# EAGLE schematic source_eagle (EAGLE 9.6.2)
COMPANY: ADAFRUIT INDUSTRIES; DRAWN: KTOWN; REV: A; YEAR: 2017
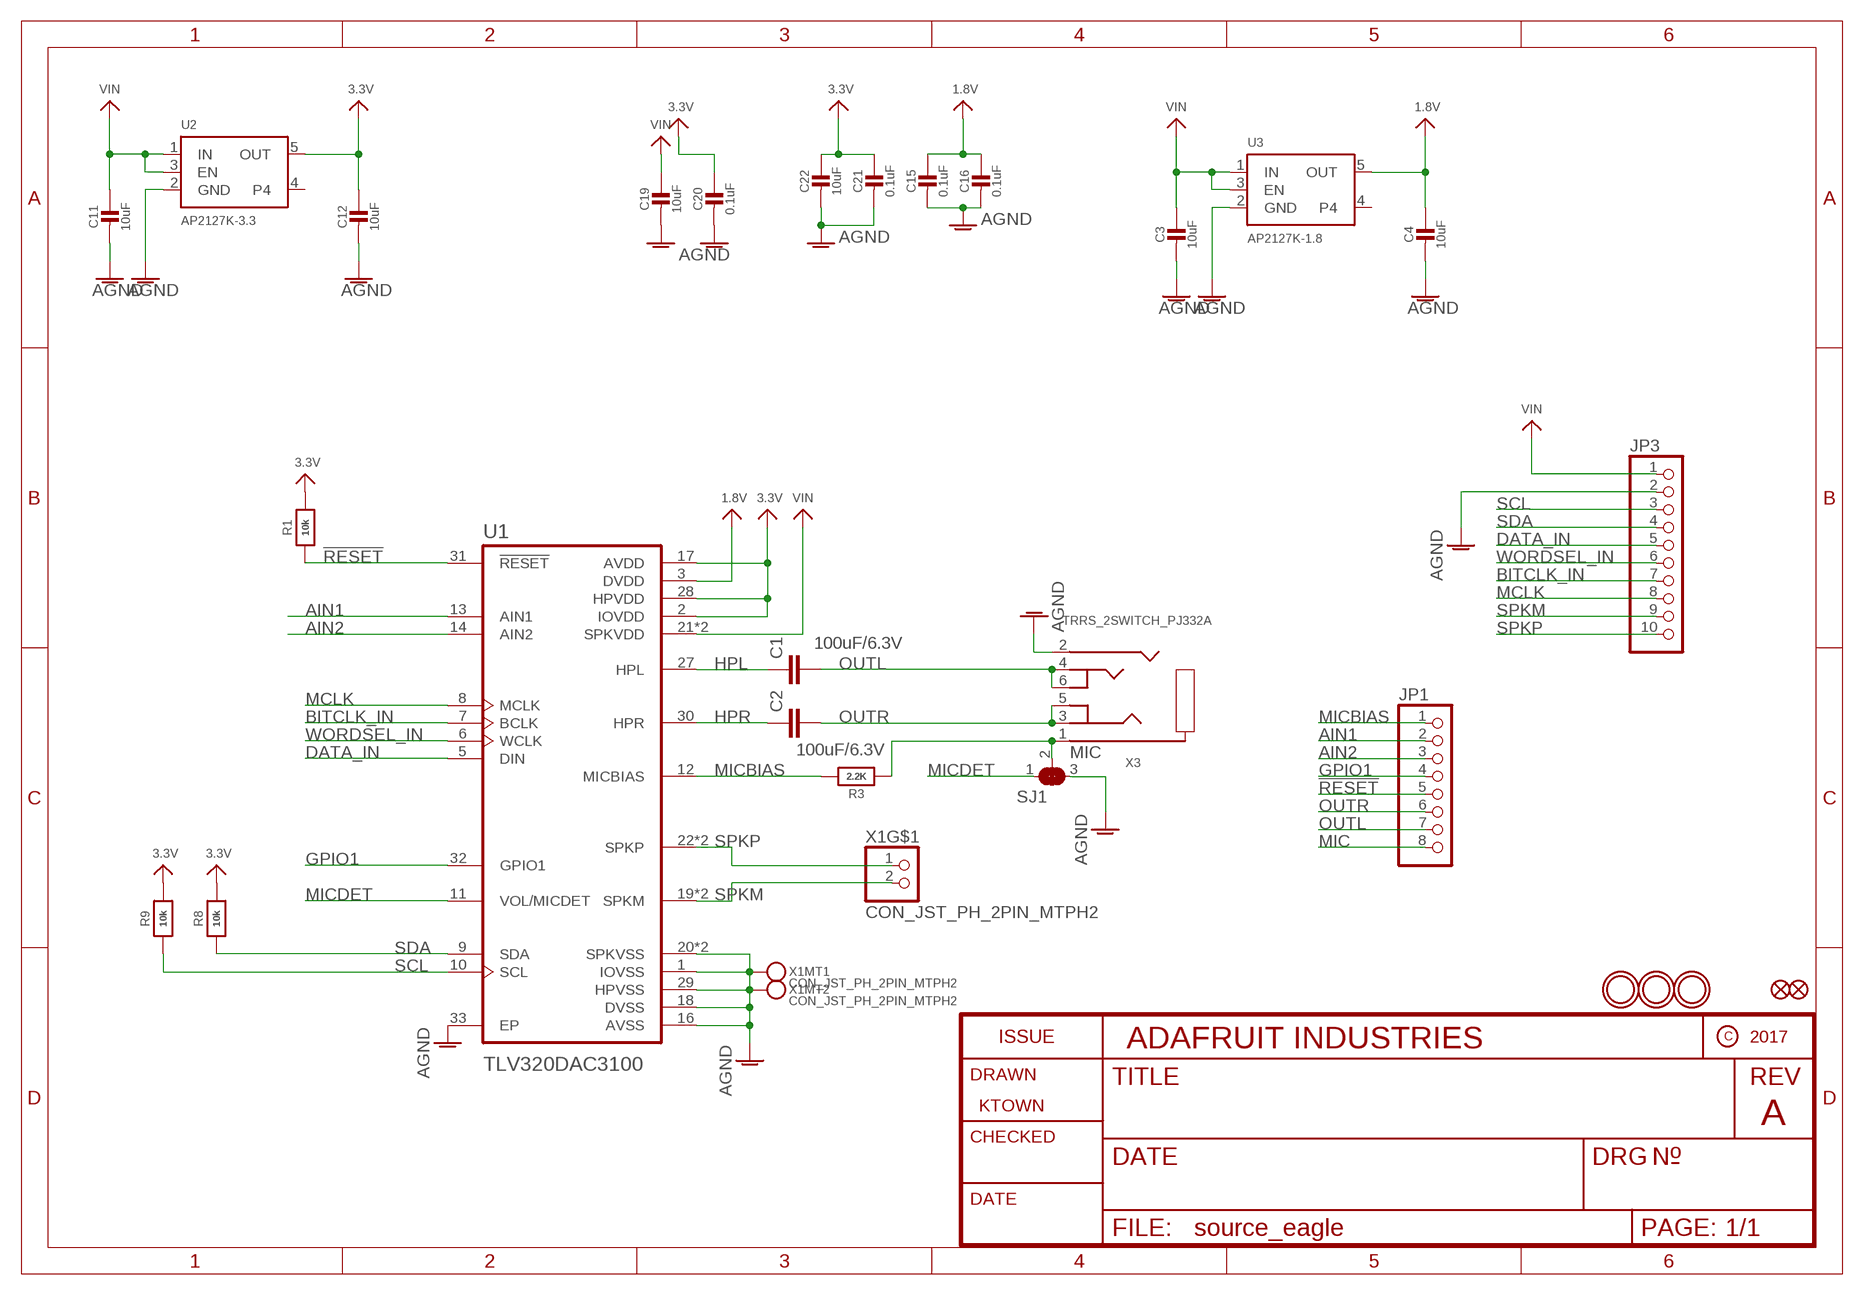
[diagram p0: schematic, sheet 1]

## Parts
C1  100uF/6.3V  C-EUC1210  [C1210]
C2  100uF/6.3V  C-EUC1210  [C1210]
C3  10uF  CAP_CERAMIC0805-NOOUTLINE  [0805-NO]
C4  10uF  CAP_CERAMIC0805-NOOUTLINE  [0805-NO]
C11  10uF  CAP_CERAMIC0805-NOOUTLINE  [0805-NO]
C12  10uF  CAP_CERAMIC0805-NOOUTLINE  [0805-NO]
C15  0.1uF  CAP_CERAMIC0603_NO  [0603-NO]
C16  0.1uF  CAP_CERAMIC0603_NO  [0603-NO]
C19  10uF  CAP_CERAMIC0805-NOOUTLINE  [0805-NO]
C20  0.1uF  CAP_CERAMIC0603_NO  [0603-NO]
C21  0.1uF  CAP_CERAMIC0603_NO  [0603-NO]
C22  10uF  CAP_CERAMIC0805-NOOUTLINE  [0805-NO]
FID1  FIDUCIAL_0.5MM  [FIDUCIAL_0.5MM]
FID2  FIDUCIAL_0.5MM  [FIDUCIAL_0.5MM]
JP1  HEADER-1X870MIL  [1X08_ROUND_70]
JP3  HEADER-1X1070MIL  [1X10_ROUND70]
R1  10k  RESISTOR_0603_NOOUT  [0603-NO]
R3  2.2K  RESISTOR_0603_NOOUT  [0603-NO]
R8  10k  RESISTOR_0603_NOOUT  [0603-NO]
R9  10k  RESISTOR_0603_NOOUT  [0603-NO]
SJ1  SOLDERJUMPER_2WAY  [SOLDERJUMPER_2WAY_OPEN_NOPASTE]
U1  TLV320DAC3100  [TLV320DAC3100]
U2  AP2127K-3.3  VREG_SOT23-5  [SOT23-5]
U3  AP2127K-1.8  VREG_SOT23-5  [SOT23-5]
U$12  MOUNTINGHOLE2.5  [MOUNTINGHOLE_2.5_PLATED]
U$13  MOUNTINGHOLE2.5  [MOUNTINGHOLE_2.5_PLATED]
U$14  MOUNTINGHOLE2.5  [MOUNTINGHOLE_2.5_PLATED]
X1  CON_JST_PH_2PIN_MTPH2  [JSTPH2]
X3  TRRS_2SWITCH_PJ332A  [PJ-332A]

## Nets
1.8V: C4.1 C15.1 C16.1 U1.3(DVDD) U3.5(OUT)
3.3V: C12.1 C20.1 C21.1 C22.1 R1.2 R8.2 R9.2 U1.2(IOVDD) U1.17(AVDD) U1.28(HPVDD) U2.5(OUT)
!RESET: JP1.5 R1.1 U1.31(!RESET)
AGND: C3.2 C4.2 C11.2 C12.2 C15.2 C16.2 C19.2 C20.2 C21.2 C22.2 JP3.2 SJ1.3 U1.1(IOVSS) U1.16(AVSS) U1.18(DVSS) U1.20(SPKVSS) U1.25(SPKVSS) U1.29(HPVSS) U1.33(EP) U2.2(GND) U3.2(GND) X1.NC1 X1.NC2 X3.2(RING1)
AIN1: JP1.2 U1.13(AIN1)
AIN2: JP1.3 U1.14(AIN2)
BITCLK_IN: JP3.7 U1.7(BCLK)
DATA_IN: JP3.5 U1.5(DIN)
GPIO1: JP1.4 U1.32(GPIO1)
HPL: C1.1 U1.27(HPL)
HPR: C2.1 U1.30(HPR)
MCLK: JP3.8 U1.8(MCLK)
MIC: JP1.8 R3.1 SJ1.2 X3.1(RING)
MICBIAS: JP1.1 R3.2 U1.12(MICBIAS)
MICDET: SJ1.1 U1.11(VOL/MICDET)
OUTL: C1.2 JP1.7 X3.4(TIP) X3.6(TIP_SW)
OUTR: C2.2 JP1.6 X3.3(RING2) X3.5(R2_SW)
SCL: JP3.3 R9.1 U1.10(SCL)
SDA: JP3.4 R8.1 U1.9(SDA)
SPKM: JP3.9 U1.19(SPKM) U1.23(SPKM) X1.2
SPKP: JP3.10 U1.22(SPKP) U1.26(SPKP) X1.1
VIN: C3.1 C11.1 C19.1 JP3.1 U1.21(SPKVDD) U1.24(SPKVDD) U2.1(IN) U2.3(EN) U3.1(IN) U3.3(EN)
WORDSEL_IN: JP3.6 U1.6(WCLK)
Unconnected: U2.4 U3.4

## Library data of the parts
C1 C2 = rcl:C-EU: CAPACITOR, European symbol; SPICEPREFIX: C
C3 C4 C11 C12 C15 C16 C19-C22 = microbuilder:CAP_CERAMIC: Ceramic Capacitors For new designs, use the packages preceded by an '_' character since they are more reliable: The following footprints should be used on most boards: _0402 - Standard footprint for regular board layouts _0603 - Standard footprint for regular board layouts _0805 - Standard footprint for regular board layouts _1206 - Standard footprint for regular board layouts For extremely tight-pitch boards where space is at a premium, the following 'micro-pitch' footprints can be used (smaller pads, no silkscreen outline, etc.): _0402MP - Micro-pitch footprint for very dense/compact boards _0603MP - Micro-pitch footprint for very dense/compact boards _0805MP - Micro-pitch footprint for very dense/compact boards _1206MP - Micro-pitch footprint for very dense/compact boards
FID1 FID2 = microbuilder:FIDUCIAL: Fiducial Alignment Points Various fiducial points for machine vision alignment.
JP1 = microbuilder:HEADER-1X8: PIN HEADER
JP3 = microbuilder:HEADER-1X10: PIN HEADER
R1 R3 R8 R9 = microbuilder:RESISTOR: Resistors For new designs, use the packages preceded by an '_' character since they are more reliable: The following footprints should be used on most boards: _0402 - Standard footprint for regular board layouts _0603 - Standard footprint for regular board layouts _0805 - Standard footprint for regular board layouts _1206 - Standard footprint for regular board layouts For extremely tight-pitch boards where space is at a premium, the following 'micro-pitch' footprints can be used (smaller pads, no silkscreen outline, etc.): _0402MP - Micro-pitch footprint for very dense/compact boards _0603MP - Micro-pitch footprint for very dense/compact boards _0805MP - Micro-pitch footprint for very dense/compact boards _1206MP - Micro-pitch footprint for very dense/compact boards
SJ1 = microbuilder:SOLDERJUMPER_2WAY: 2-Way Solder Jumper
U1 = microbuilder:TLV320DAC3100
U2 U3 = adafruit_power:VREG_SOT23-5: SOT23-5 Fixed Voltage Regulators Part Current Out V Out V In V Dropout θJA (°C/W) TJ (°C) Digikey Part No. ADP121 150mA 3.3V 3.4-5.5V 0.09V @ 150mA -- -- ADP121-AUJZ33R7CT-ND ADP121 150mA 3.0V 3.1-5.5V 0.09V @ 150mA -- -- ADP121-AUJZ30R7CT-ND ADP122 300mA 3.3V 3.4-5.5V 0.085V @ 300mA -- -- ADP122AUJZ-3.3-R7CT-ND ADP1712 300mA 3.3V 3.5-5.5V 0.17V @ 300mA -- -- ADP1712AUJZ-3.3-R7TR-ND AP7311 (Low Cost) 150mA 3.3V 3.5-6V 0.15V @ 150mA -- -- AP7311-33WG-7DICT-ND LD39015M18R 150mA 1.8V 1.9V-5.5V 0.08V @ 100mA -- -- 497-6977-1-ND LP2985A-33DBVR 150mA 3.3V 3.3-16V 0.28V @ 150mA 206 150 296-18479-1-ND MCP1824T-3302E/OT 300mA 3.3V 3.5V-6V 0.2V @ 300mA -- -- MCP1824T-3302E/OTCT-ND MIC5205-2.5YM5 TR 150mA 2.5V 2.7-16V 0.165V @ 150mA -- -- 576-1257-2-ND MIC5205-3.0YM5 TR 150mA 3.0V 3.2V-16V 0.165V @ 150mA -- -- 576-1258-2-ND MIC5205-3.3YM5 TR 150mA 3.3V 3.5V-16V 0.165V @ 150mA -- -- 576-1259-2-ND TPS780330220 150mA 3.3V+2.2V 3.6-5.5V 250mV Max -- -- 296-23332-1-ND TDA3663/N1,135 100mA 3.3V 3.5-45V 0.18V @ 50mA -- -- 568-5343-1-ND Max operating temp can be calculated using θJA, TJ (max junction temperature), and power in watts. Set the "Maximum Ambient Temperature" until it reaches TJ ("Max Junction Temperature"), which is the absolute limit for safe use of the regulator: Heat Sink Temperature Calculator <http://www.daycounter.com/Calculators/Heat-Sink-Temperature-Calculator.phtml> For example, With 12V source into a 3.3V LP2985 and a 30mA load, we are dissipating (12V-3.3V) * 0.03A = 0.261W. With a θJA of 206 °C/W, a TJ of 150°C, and 261mW we can safely use the chip without a heat sink up to 75°C (=147.1°C Junction Temperature).; JLC_ROTATION: 270
U$12-U$14 = adafruit_electromech:MOUNTINGHOLE: Mounting Hole For #2 screws (0.086"/2.18mm width, 0.094"/2.4mm hole) use 2.5mm; BOM: EXCLUDE
X1 = adafruit_electromech:CON_JST_PH_2PIN_MT; LCSC: C47647
X3 = adafruit_electromech:TRRS_2SWITCH